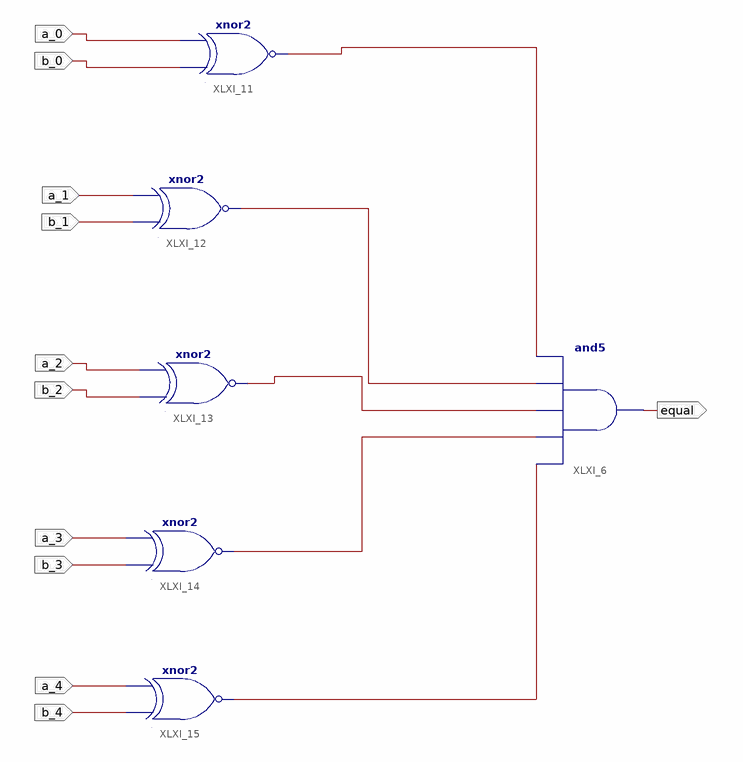
[diagram p0: schematic sheet 1]
// Xilinx ISE schematic check_equal_and_equal.sch (spartan3adsp) as structural Verilog: 6 symbols, 11 ports
module check_equal_and_equal (
  input  a_0,
  input  b_0,
  input  a_1,
  input  b_1,
  input  a_2,
  input  b_2,
  input  a_3,
  input  b_3,
  input  a_4,
  input  b_4,
  output equal
);

  wire XLXN_1, XLXN_2, XLXN_4, XLXN_5, XLXN_10;

  and XLXI_6 (equal, XLXN_5, XLXN_4, XLXN_10, XLXN_2, XLXN_1);
  xnor XLXI_11 (XLXN_1, b_0, a_0);
  xnor XLXI_12 (XLXN_2, b_1, a_1);
  xnor XLXI_13 (XLXN_10, b_2, a_2);
  xnor XLXI_14 (XLXN_4, b_3, a_3);
  xnor XLXI_15 (XLXN_5, b_4, a_4);
endmodule
